# EAGLE design Prototype_Rx (EAGLE 9.5.0)
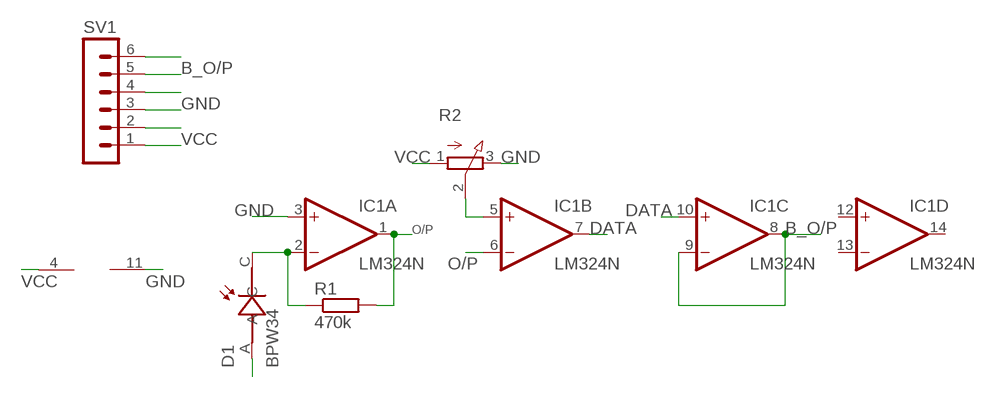
[diagram p0: schematic, sheet 1]

## Parts
D1  BPW34  [PHODET_BPW34]
IC1  LM324N  [DIL14]
R1  470k  R-EU_0207/10  [0207/10]
R2  3RP/1610N  [3RP/1610N]
SV1  MA06-1  [MA06-1]

## Nets
B_O/P: IC1.8(C:OUT) IC1.9(C:-IN) SV1.5 SV1.6
DATA: IC1.7(B:OUT) IC1.10(C:+IN)
GND: D1.A IC1.3(A:+IN) IC1.11(P:V-) R2.3(E) SV1.3 SV1.4
N$1: D1.C IC1.2(A:-IN) R1.1
N$2: IC1.5(B:+IN) R2.2(S)
O/P: IC1.1(A:OUT) IC1.6(B:-IN) R1.2
VCC: IC1.4(P:V+) R2.1(A) SV1.1 SV1.2
Unconnected: IC1.12(D:+IN) IC1.13(D:-IN) IC1.14(D:OUT)

## Library data of the parts
D1 = BPW34:BPW34: PIN IR photodiode; DIL; 400-1100nm; 150mW; 60°; λp max:; AVAILABILITY: Unavailable; DESCRIPTION: PIN IR photodiode; DIL; 400-1100nm; 150mW; 60°; λp max:; MF: Vishay Semiconductor; MP: BPW34; PACKAGE: DIP-2 Osram Opto; PRICE: None
IC1 = linear:LM324: OP AMP
R1 = rcl:R-EU_: RESISTOR, European symbol; SPICEPREFIX: R
R2 = pot:3RP/1610N: 16mm Potentiometer one level Source: http://www.alphapotentiometers.net/html/16mm_pot_2.html
SV1 = con-lstb:MA06-1: PIN HEADER; OC_FARNELL: unknown; OC_NEWARK: unknown

## Board
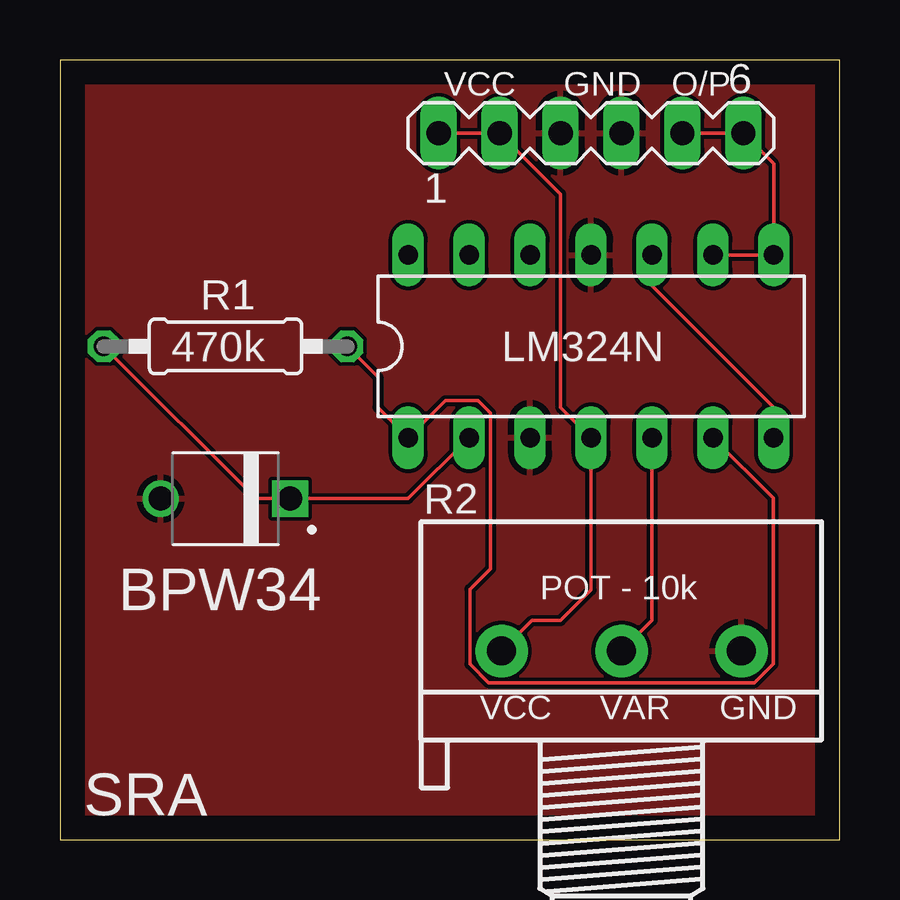
[diagram p1: board, top side]

Size 32.5 x 32.5 mm. Coordinates in mm from the lower left corner, seen from the top.
Outline: 0,0 32.5,0 32.5,32.5 0,32.5 0,0
Copper layers (1*16): Top 0.035mm / dielectric 0.15mm / Bottom 0.035mm
Design rules "default": minimum track width 6mil, minimum drill 0.35mm, track to track 6mil, track to pad 6mil, pad to pad 6mil, via to via 6mil, smd to smd 6mil, copper to edge 40mil, drill to drill 6mil, minimum pad ring 10mil, minimum via ring 8mil, stop-mask expansion 4mil, vias tented up to drill 0mil, thermal gap 10mil

### Footprints (pad centres in the part's own frame; a part is rotated, then mirrored left to right if it is on the bottom)
PHODET_BPW34 = drill 1: A 2.7,0 | drill 1 square: C -2.7,0
DIL14 = drill 0.813 long: 1 -7.62,-3.81; 2 -5.08,-3.81; 3 -2.54,-3.81; 4 0,-3.81; 5 2.54,-3.81; 6 5.08,-3.81; 7 7.62,-3.81; 8 7.62,3.81; 9 5.08,3.81; 10 2.54,3.81; 11 0,3.81; 12 -2.54,3.81; 13 -5.08,3.81; 14 -7.62,3.81
0207/10 = drill 0.813 octagon: 1 -5.08,0; 2 5.08,0
3RP/1610N = drill 1.2 pad 2.184: 1 -5,0; 2 0,0; 3 5,0
MA06-1 = drill 1.016 long: 1 -6.35,0; 2 -3.81,0; 3 -1.27,0; 4 1.27,0; 5 3.81,0; 6 6.35,0

### Placement (x,y rotation side)
D1  6.9,14.21 180 top
IC1  22.14,20.56 0 top
R1  6.9,20.56 0 top
R2  23.41,7.86 0 top
SV1  22.14,29.45 0 top

### Tracks (layer width: path | path; a pad name or v marks a point on that pad's centre or on a via)
B_O/P
  Top 0.152: SV1.5 SV1.6 29.76,28.18 IC1.8 IC1.9
DATA
  Top 0.152: IC1.7 29.76,18.02 24.68,23.1 IC1.10
GND
  pour Top (isolate 0.012): 0,32.5 0,0 32.5,0 32.5,32.5
N$1
  Top 0.152: IC1.2 14.52,14.21 D1.C 8.17,14.21 R1.1
N$2
  Top 0.152: IC1.5 24.68,9.13 R2.2
O/P
  Top 0.152: R1.2 13.25,19.29 13.25,18.02 IC1.1 16.07,18.3 17.43,18.3 17.95,17.78 17.95,11.29 17.09,10.43 17.09,7.31 17.86,6.54 28.96,6.54 29.73,7.31 29.73,14.24 IC1.6
VCC
  Top 0.152: SV1.1 SV1.2 20.87,26.91 20.87,18.02 IC1.4 22.14,10.4 20.87,9.13 19.68,9.13 R2.1

### Text on the board
tNames: VCC | GND | O/P | POT - 10k | VCC | VAR | GND | SRA